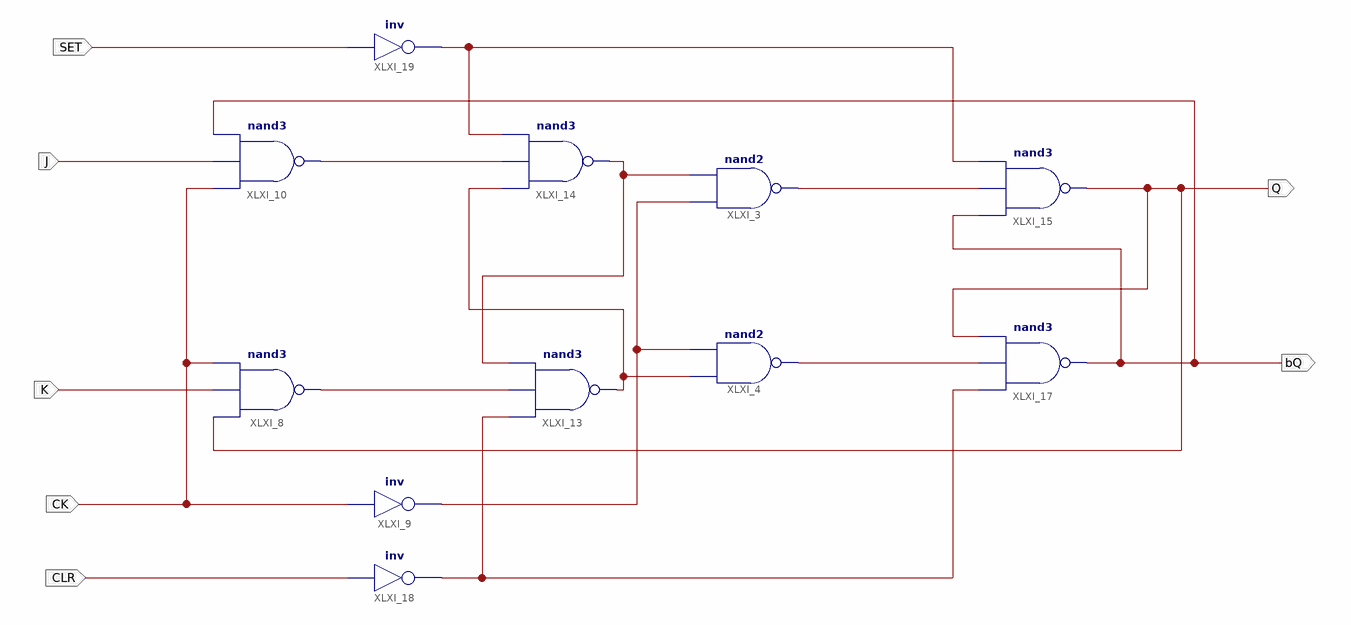
[diagram p0: schematic sheet 1]
// Xilinx ISE schematic JK_FF_NE.sch (spartan6) as structural Verilog: 11 symbols, 7 ports
module JK_FF_NE (
  input  CK,
  input  K,
  input  J,
  input  CLR,
  input  SET,
  output bQ,
  output Q
);

  wire XLXN_3, XLXN_4, XLXN_5, XLXN_7, XLXN_16, XLXN_25, XLXN_27, XLXN_43, XLXN_45;

  nand XLXI_3 (XLXN_3, XLXN_27, XLXN_25);
  nand XLXI_4 (XLXN_7, XLXN_5, XLXN_27);
  nand XLXI_8 (XLXN_4, Q, K, CK);
  not XLXI_9 (XLXN_27, CK);
  nand XLXI_10 (XLXN_16, CK, J, bQ);
  nand XLXI_13 (XLXN_5, XLXN_43, XLXN_4, XLXN_25);
  nand XLXI_14 (XLXN_25, XLXN_5, XLXN_16, XLXN_45);
  nand XLXI_15 (Q, bQ, XLXN_3, XLXN_45);
  nand XLXI_17 (bQ, XLXN_43, XLXN_7, Q);
  not XLXI_18 (XLXN_43, CLR);
  not XLXI_19 (XLXN_45, SET);
endmodule
